# Altium project 5M160ZE64.PrjPcb
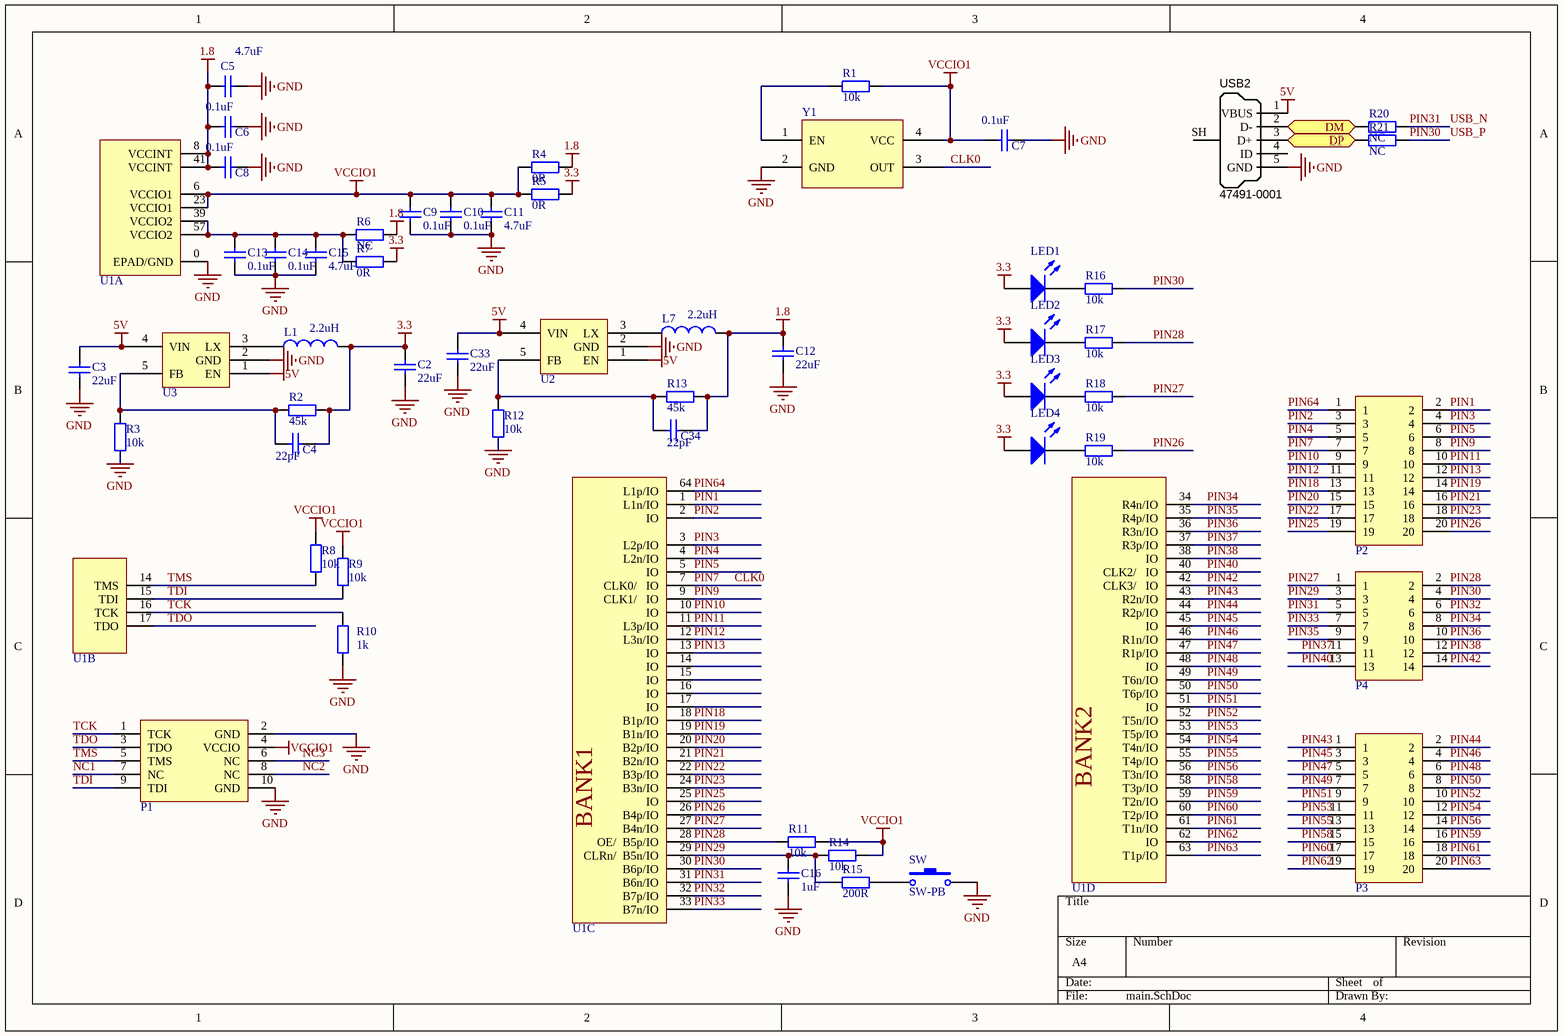
[diagram p0: main.SchDoc]
1 sheet, 54 parts. Net scope: flat (ports and power ports of the same name join across sheets).
Board file: 5M160ZE64.PcbDoc

## Sheet main.SchDoc
size A4

### Parts
C2  value 22uF  [0805]  (hidden comment: Cap)
C3  value 22uF  [0805]  (hidden comment: Cap)
C4  22pF  [0402]
C5  4.7uF  [0603]
C6  0.1uF  [0402]
C7  0.1uF  [0402]
C8  0.1uF  [0402]
C9  0.1uF  [0402]
C10  0.1uF  [0402]
C11  4.7uF  [0603]
C12  value 22uF  [0805]  (hidden comment: Cap)
C13  0.1uF  [0402]
C14  0.1uF  [0402]
C15  4.7uF  [0603]
C16  1uF  [0402]
C33  value 22uF  [0805]  (hidden comment: Cap)
C34  22pF  [0402]
L1  2.2uH  [0806]
L7  2.2uH  [0806]
LED1  LED0  [0603]  (value not drawn)
LED2  LED0  [0603]  (value not drawn)
LED3  LED0  [0603]  (value not drawn)
LED4  LED0  [0603]  (value not drawn)
P1  USB_BLASTER_JTAG  [USB_BLASTER_JTAG_SIDE]  (value not drawn)
P2  10P*2  [10P*2, SIDE]  (value not drawn)
P3  10P*2  [10P*2, SIDE]  (value not drawn)
P4  7P*2  [7P*2, SIDE]  (value not drawn)
R1  10k  [0402]
R2  45k  [0402]
R3  10k  [0402]
R4  0R  [0402]
R5  0R  [0402]
R6  NC  [0402]
R7  0R  [0402]
R8  10k  [0402]
R9  10k  [0402]
R10  1k  [0402]
R11  10k  [0402]
R12  10k  [0402]
R13  45k  [0402]
R14  10k  [0402]
R15  200R  [0402]
R16  10k  [0402]
R17  10k  [0402]
R18  10k  [0402]
R19  10k  [0402]
R20  NC  [0402]
R21  NC  [0402]
SW  SW-PB  [SW3x4]
U1  5M160ZE64  [5M160ZE64]  (value not drawn)  (parts A,B,C,D of 4)
U2  RT8059  [SOT23-5]  (value not drawn)
U3  RT8059  [SOT23-5]  (value not drawn)
USB2  Manufacturer Part Number 1: 47491-0001  [MICRO-YZX]  (hidden comment: USB Micro Type B)
Y1  OSC_50M  [TXC_7Q]  (value not drawn)

### Ports
DM, DP

### Nets
1.8: C5.2 C6.2 C8.2 C12.2 C34.1 L7.2 R4.2 R6.2 R13.2 U1.8(VCCINT) U1.41(VCCINT)
3.3: C2.2 C4.1 L1.2 LED1.1(A) LED2.1(A) LED3.1(A) LED4.1(A) R2.2 R5.2 R7.2
5V: C3.2 C33.2 U2.1(EN) U2.4(VIN) U3.1(EN) U3.4(VIN) USB2.1(VBUS)
GND: C2.1 C3.1 C5.1 C6.1 C7.1 C8.1 C9.1 C10.1 C11.1 C12.1 C13.1 C14.1 C15.1 C16.2 C33.1 P1.2(GND) P1.10(GND) R3.1 R10.1 R12.1 SW.2 U1.0(EPAD/GND) U2.2(GND) U3.2(GND) USB2.5(GND) Y1.2(GND)
VCCIO1: C7.2 C9.2 C10.2 C11.2 P1.4(VCCIO) R1.2 R4.1 R5.1 R8.2 R9.2 R11.2 R14.2 U1.6(VCCIO1) U1.23(VCCIO1) Y1.4(VCC)
CLK0: P2.7 U1.7(CLK0/___IO) Y1.3(OUT)  [also labelled PIN7]
NC1: P1.7(NC)
NC2: P1.8(NC)
NC3: P1.6(NC)
PIN1: P2.2 U1.1(L1n/IO)
PIN2: P2.3 U1.2(IO)
PIN3: P2.4 U1.3(L2p/IO)
PIN4: P2.5 U1.4(L2n/IO)
PIN5: P2.6 U1.5(IO)
PIN9: P2.8 U1.9(CLK1/___IO)
PIN10: P2.9 U1.10(IO)
PIN11: P2.10 U1.11(L3p/IO)
PIN12: P2.11 U1.12(L3n/IO)
PIN13: P2.12 U1.13(IO)
PIN18: P2.13 U1.18(B1p/IO)
PIN19: P2.14 U1.19(B1n/IO)
PIN20: P2.15 U1.20(B2p/IO)
PIN21: P2.16 U1.21(B2n/IO)
PIN22: P2.17 U1.22(B3p/IO)
PIN23: P2.18 U1.24(B3n/IO)
PIN25: P2.19 U1.25(IO)
PIN26: P2.20 R19.2 U1.26(B4p/IO)
PIN27: P4.1 R18.2 U1.27(B4n/IO)
PIN28: P4.2 R11.1 R17.2 U1.28(OE/__B5p/IO)
PIN29: C16.1 P4.3 R14.1 R15.1 U1.29(CLRn/__B5n/IO)
PIN30: P4.4 R16.2 R21.2 U1.30(B6p/IO)  [also labelled USB_P]
PIN31: P4.5 R20.2 U1.31(B6n/IO)  [also labelled USB_N]
PIN32: P4.6 U1.32(B7p/IO)
PIN33: P4.7 U1.33(B7n/IO)
PIN34: P4.8 U1.34(R4n/IO)
PIN35: P4.9 U1.35(R4p/IO)
PIN36: P4.10 U1.36(R3n/IO)
PIN37: P4.11 U1.37(R3p/IO)
PIN38: P4.12 U1.38(IO)
PIN40: P4.13 U1.40(CLK2/___IO)
PIN42: P4.14 U1.42(CLK3/___IO)
PIN43: P3.1 U1.43(R2n/IO)
PIN44: P3.2 U1.44(R2p/IO)
PIN45: P3.3 U1.45(IO)
PIN46: P3.4 U1.46(R1n/IO)
PIN47: P3.5 U1.47(R1p/IO)
PIN48: P3.6 U1.48(IO)
PIN49: P3.7 U1.49(T6n/IO)
PIN50: P3.8 U1.50(T6p/IO)
PIN51: P3.9 U1.51(IO)
PIN52: P3.10 U1.52(T5n/IO)
PIN53: P3.11 U1.53(T5p/IO)
PIN54: P3.12 U1.54(T4n/IO)
PIN55: P3.13 U1.55(T4p/IO)
PIN56: P3.14 U1.56(T3n/IO)
PIN58: P3.15 U1.58(T3p/IO)
PIN59: P3.16 U1.59(T2n/IO)
PIN60: P3.17 U1.60(T2p/IO)
PIN61: P3.18 U1.61(T1n/IO)
PIN62: P3.19 U1.62(IO)
PIN63: P3.20 U1.63(T1p/IO)
PIN64: P2.1 U1.64(L1p/IO)
TCK: P1.1(TCK) R10.2 U1.16(TCK)
TDI: P1.9(TDI) R9.1 U1.15(TDI)
TDO: P1.3(TDO) U1.17(TDO)
TMS: P1.5(TMS) R8.1 U1.14(TMS)
NetC4_2: C4.2 R2.1 R3.2 U3.5(FB)
NetC13_2: C13.2 C14.2 C15.2 R6.1 R7.1 U1.39(VCCIO2) U1.57(VCCIO2)
NetC34_2: C34.2 R12.2 R13.1 U2.5(FB)
NetL1_1: L1.1 U3.3(LX)
NetL7_1: L7.1 U2.3(LX)
NetLED1_2: LED1.2(K) R16.1
NetLED2_2: LED2.2(K) R17.1
NetLED3_2: LED3.2(K) R18.1
NetLED4_2: LED4.2(K) R19.1
NetR1_1: R1.1 Y1.1(EN)
NetR15_2: R15.2 SW.1
NetR20_1: R20.1 USB2.2(D-) ; port DM
NetR21_1: R21.1 USB2.3(D+) ; port DP

Not connected (* = marked no-connect by the designer): USB2 4(ID) SH(Shell)

### Notes on the sheet
- (in symbol 5M160ZE64, part C) BANK1
- (in symbol 5M160ZE64, part D) BANK2

### Library data of the parts
C2-C16 C33 C34 = Cap: Capacitor; Published: 8-Jun-2000; LatestRevisionDate: 17-Jul-2002; LatestRevisionNote: Re-released for DXP Platform.; PackageReference: RAD-0.3; Publisher: Altium Limited; PackageDescription: Radial Cap, Thru-Hole; 2 Leads; 0.3 in Pin Spacing
L1 L7 = Inductor: Code_IEC: 1005; Published: 8-Jun-2000; LatestRevisionDate: 29-May-2009; LatestRevisionNote: IPC-7351 Footprint Added.; PackageReference: 0402-A; Publisher: Altium Limited; PackageDescription: Chip Inductor; Code_JEITA: 0402
LED1-LED4 = LED0: Typical INFRARED GaAs LED; Published: 8-Jun-2000; LatestRevisionDate: 08-Jul-2005; LatestRevisionNote: Mech Layer 1 removed.; PackageReference: LED-0; Publisher: Altium Limited; PackageDescription: LED; 2 Leads
R1-R21 = Res2: Resistor; Published: 8-Jun-2000; LatestRevisionDate: 17-Jul-2002; LatestRevisionNote: Re-released for DXP Platform.; PackageReference: AXIAL-0.4; Publisher: Altium Limited; PackageDescription: Axial Device, Thru-Hole; 2 Leads; 0.4 in Pin Spacing
SW = SW-PB: Switch; Published: 24-Mar-1999; LatestRevisionDate: 17-Jul-2002; LatestRevisionNote: Re-released for DXP Platform.; PackageReference: SPST-2; Publisher: Altium Limited; PackageDescription: Switch; 2 Leads
USB2 = USB_Micro_TypeB: Connector SMD USB Micro Type B middle mount; Manufacturer 1: Molex Inc; SCDType: undef; Package / Case: SMD; Supplier 1: Digi-Key; Supplier Part Number 1: WM17142CT-ND